# Altium schematic sheet LED PD AB WH 3000149 (4F00228L_7P00501A)_sch.SchDoc
size A3
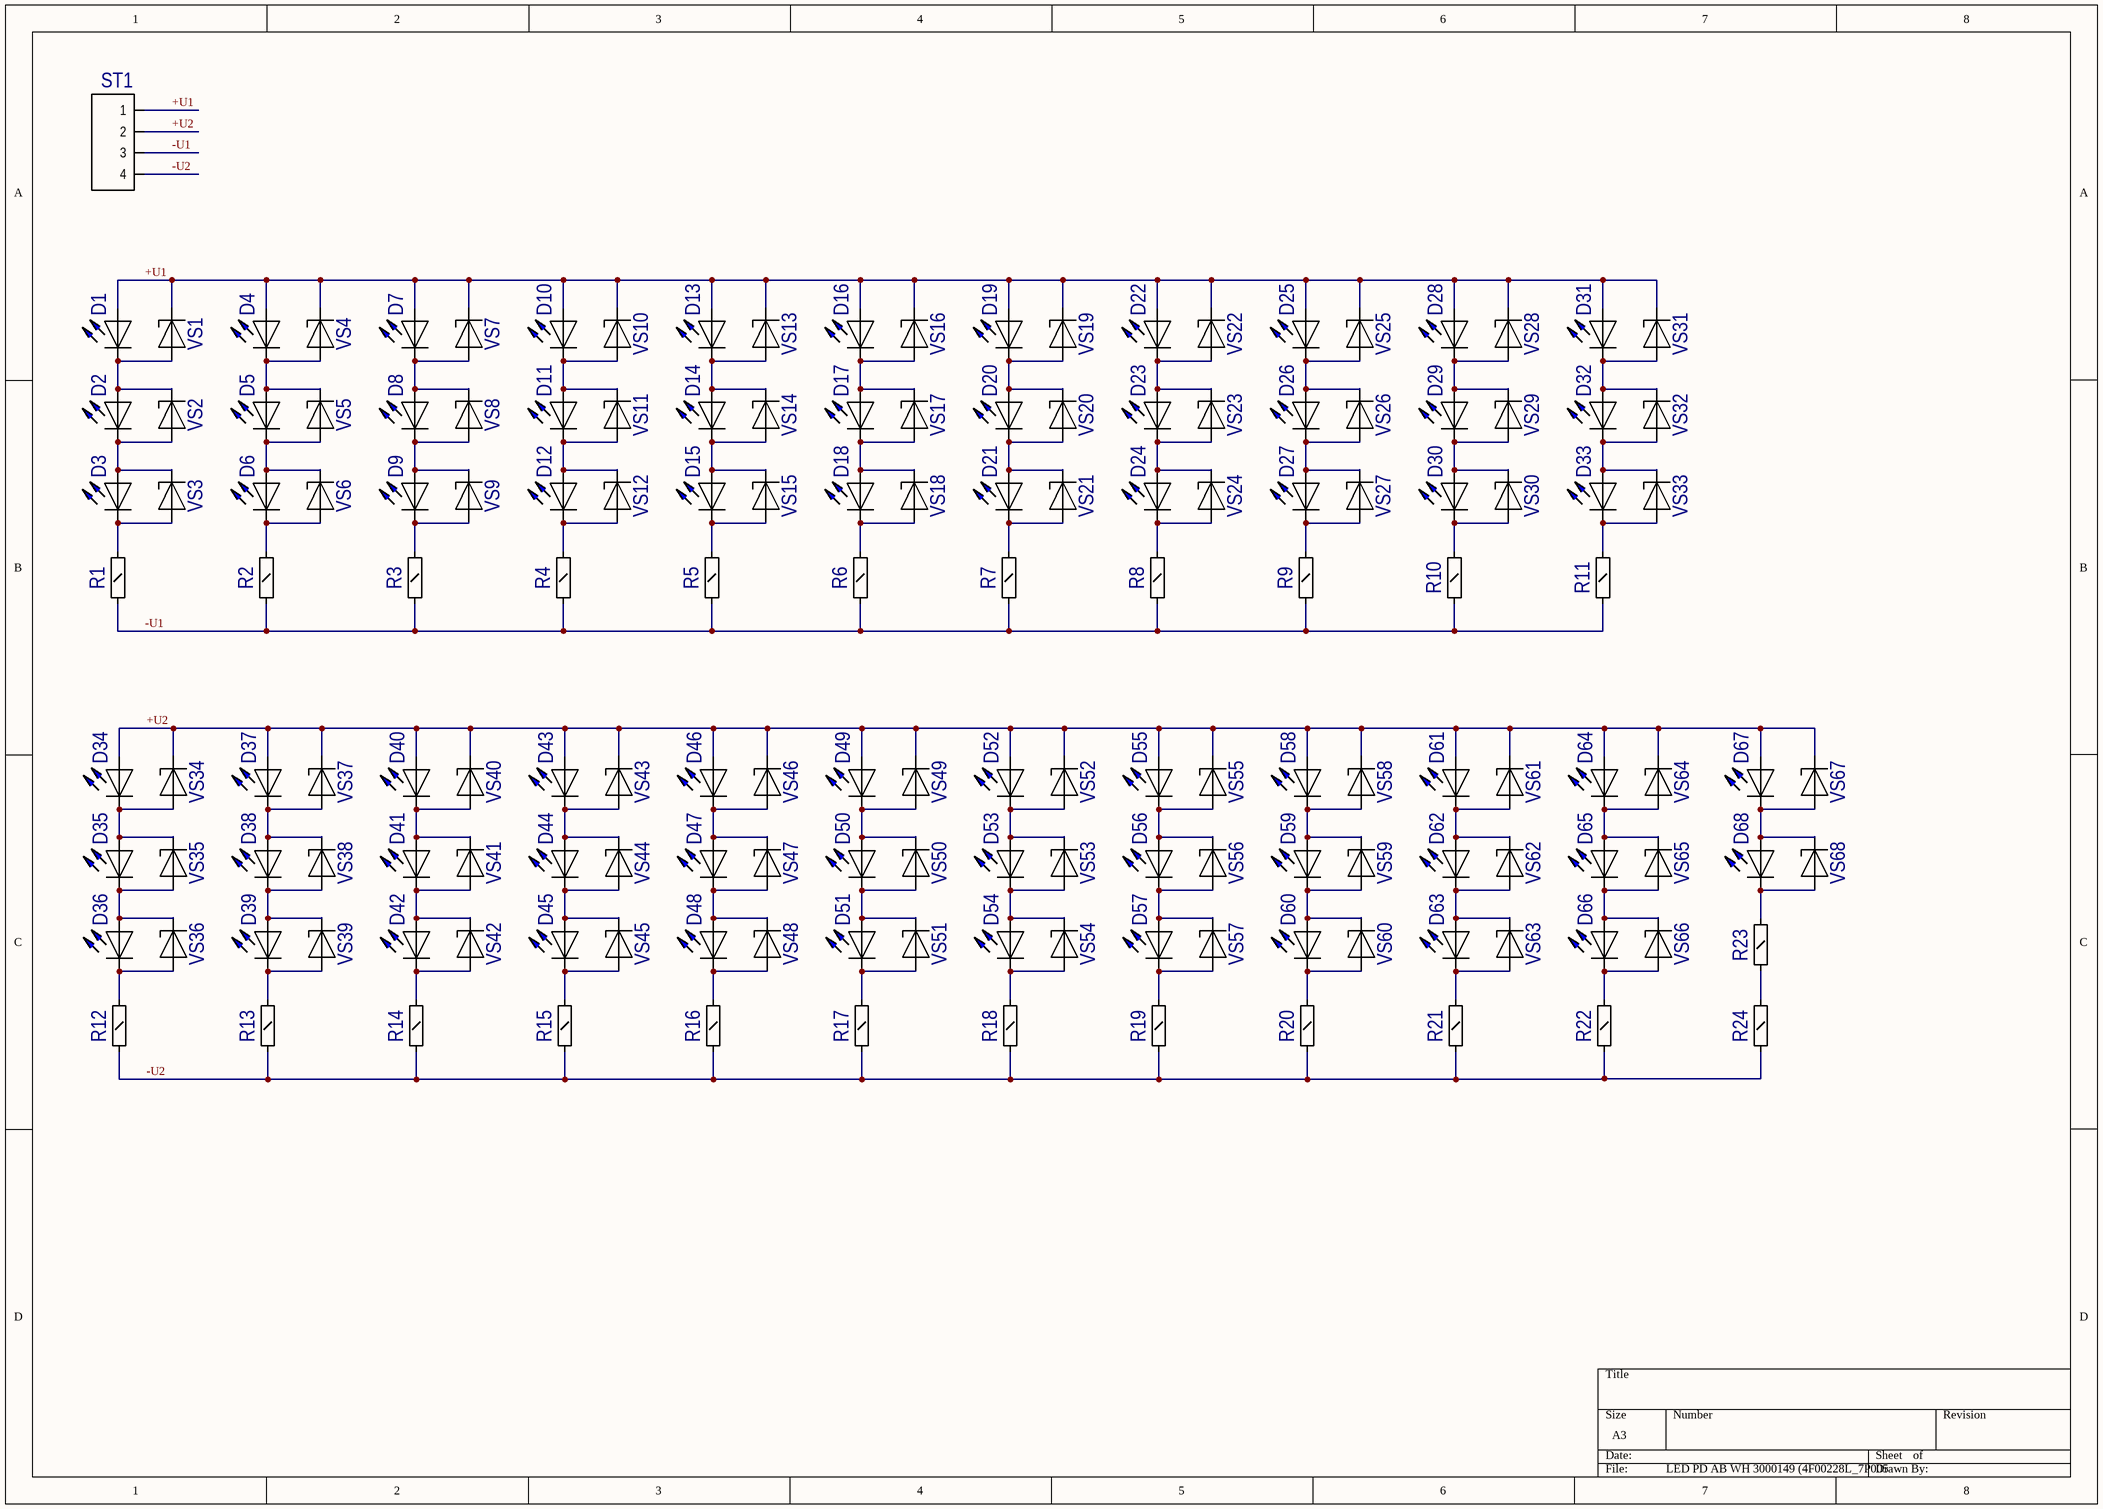
[diagram p0: LED PD AB WH 3000149 (4F00228L_7P00501A)_sch.SchDoc]

## Parts
D1  LT_T66G  [T66G]  (value not drawn)
D2  LT_T66G  [T66G]  (value not drawn)
D3  LT_T66G  [T66G]  (value not drawn)
D4  LT_T66G  [T66G]  (value not drawn)
D5  LT_T66G  [T66G]  (value not drawn)
D6  LT_T66G  [T66G]  (value not drawn)
D7  LT_T66G  [T66G]  (value not drawn)
D8  LT_T66G  [T66G]  (value not drawn)
D9  LT_T66G  [T66G]  (value not drawn)
D10  LT_T66G  [T66G]  (value not drawn)
D11  LT_T66G  [T66G]  (value not drawn)
D12  LT_T66G  [T66G]  (value not drawn)
D13  LT_T66G  [T66G]  (value not drawn)
D14  LT_T66G  [T66G]  (value not drawn)
D15  LT_T66G  [T66G]  (value not drawn)
D16  LT_T66G  [T66G]  (value not drawn)
D17  LT_T66G  [T66G]  (value not drawn)
D18  LT_T66G  [T66G]  (value not drawn)
D19  LT_T66G  [T66G]  (value not drawn)
D20  LT_T66G  [T66G]  (value not drawn)
D21  LT_T66G  [T66G]  (value not drawn)
D22  LT_T66G  [T66G]  (value not drawn)
D23  LT_T66G  [T66G]  (value not drawn)
D24  LT_T66G  [T66G]  (value not drawn)
D25  LT_T66G  [T66G]  (value not drawn)
D26  LT_T66G  [T66G]  (value not drawn)
D27  LT_T66G  [T66G]  (value not drawn)
D28  LT_T66G  [T66G]  (value not drawn)
D29  LT_T66G  [T66G]  (value not drawn)
D30  LT_T66G  [T66G]  (value not drawn)
D31  LT_T66G  [T66G]  (value not drawn)
D32  LT_T66G  [T66G]  (value not drawn)
D33  LT_T66G  [T66G]  (value not drawn)
D34  LT_T66G  [T66G]  (value not drawn)
D35  LT_T66G  [T66G]  (value not drawn)
D36  LT_T66G  [T66G]  (value not drawn)
D37  LT_T66G  [T66G]  (value not drawn)
D38  LT_T66G  [T66G]  (value not drawn)
D39  LT_T66G  [T66G]  (value not drawn)
D40  LT_T66G  [T66G]  (value not drawn)
D41  LT_T66G  [T66G]  (value not drawn)
D42  LT_T66G  [T66G]  (value not drawn)
D43  LT_T66G  [T66G]  (value not drawn)
D44  LT_T66G  [T66G]  (value not drawn)
D45  LT_T66G  [T66G]  (value not drawn)
D46  LT_T66G  [T66G]  (value not drawn)
D47  LT_T66G  [T66G]  (value not drawn)
D48  LT_T66G  [T66G]  (value not drawn)
D49  LT_T66G  [T66G]  (value not drawn)
D50  LT_T66G  [T66G]  (value not drawn)
D51  LT_T66G  [T66G]  (value not drawn)
D52  LT_T66G  [T66G]  (value not drawn)
D53  LT_T66G  [T66G]  (value not drawn)
D54  LT_T66G  [T66G]  (value not drawn)
D55  LT_T66G  [T66G]  (value not drawn)
D56  LT_T66G  [T66G]  (value not drawn)
D57  LT_T66G  [T66G]  (value not drawn)
D58  LT_T66G  [T66G]  (value not drawn)
D59  LT_T66G  [T66G]  (value not drawn)
D60  LT_T66G  [T66G]  (value not drawn)
D61  LT_T66G  [T66G]  (value not drawn)
D62  LT_T66G  [T66G]  (value not drawn)
D63  LT_T66G  [T66G]  (value not drawn)
D64  LT_T66G  [T66G]  (value not drawn)
D65  LT_T66G  [T66G]  (value not drawn)
D66  LT_T66G  [T66G]  (value not drawn)
D67  LT_T66G  [T66G]  (value not drawn)
D68  LT_T66G  [T66G]  (value not drawn)
R1  R1206S  [RC1206S]  (value not drawn)
R2  R1206S  [RC1206S]  (value not drawn)
R3  R1206S  [RC1206S]  (value not drawn)
R4  R1206S  [RC1206S]  (value not drawn)
R5  R1206S  [RC1206S]  (value not drawn)
R6  R1206S  [RC1206S]  (value not drawn)
R7  R1206S  [RC1206S]  (value not drawn)
R8  R1206S  [RC1206S]  (value not drawn)
R9  R1206S  [RC1206S]  (value not drawn)
R10  R1206S  [RC1206S]  (value not drawn)
R11  R1206S  [RC1206S]  (value not drawn)
R12  R1206S  [RC1206S]  (value not drawn)
R13  R1206S  [RC1206S]  (value not drawn)
R14  R1206S  [RC1206S]  (value not drawn)
R15  R1206S  [RC1206S]  (value not drawn)
R16  R1206S  [RC1206S]  (value not drawn)
R17  R1206S  [RC1206S]  (value not drawn)
R18  R1206S  [RC1206S]  (value not drawn)
R19  R1206S  [RC1206S]  (value not drawn)
R20  R1206S  [RC1206S]  (value not drawn)
R21  R1206S  [RC1206S]  (value not drawn)
R22  R1206S  [RC1206S]  (value not drawn)
R23  R1206S  [RC1206S]  (value not drawn)
R24  R1206S  [RC1206S]  (value not drawn)
ST1  BAND4  [BAND4]  (value not drawn)
VS1  BZX84  [SOT23]  (value not drawn)
VS2  BZX84  [SOT23]  (value not drawn)
VS3  BZX84  [SOT23]  (value not drawn)
VS4  BZX84  [SOT23]  (value not drawn)
VS5  BZX84  [SOT23]  (value not drawn)
VS6  BZX84  [SOT23]  (value not drawn)
VS7  BZX84  [SOT23]  (value not drawn)
VS8  BZX84  [SOT23]  (value not drawn)
VS9  BZX84  [SOT23]  (value not drawn)
VS10  BZX84  [SOT23]  (value not drawn)
VS11  BZX84  [SOT23]  (value not drawn)
VS12  BZX84  [SOT23]  (value not drawn)
VS13  BZX84  [SOT23]  (value not drawn)
VS14  BZX84  [SOT23]  (value not drawn)
VS15  BZX84  [SOT23]  (value not drawn)
VS16  BZX84  [SOT23]  (value not drawn)
VS17  BZX84  [SOT23]  (value not drawn)
VS18  BZX84  [SOT23]  (value not drawn)
VS19  BZX84  [SOT23]  (value not drawn)
VS20  BZX84  [SOT23]  (value not drawn)
VS21  BZX84  [SOT23]  (value not drawn)
VS22  BZX84  [SOT23]  (value not drawn)
VS23  BZX84  [SOT23]  (value not drawn)
VS24  BZX84  [SOT23]  (value not drawn)
VS25  BZX84  [SOT23]  (value not drawn)
VS26  BZX84  [SOT23]  (value not drawn)
VS27  BZX84  [SOT23]  (value not drawn)
VS28  BZX84  [SOT23]  (value not drawn)
VS29  BZX84  [SOT23]  (value not drawn)
VS30  BZX84  [SOT23]  (value not drawn)
VS31  BZX84  [SOT23]  (value not drawn)
VS32  BZX84  [SOT23]  (value not drawn)
VS33  BZX84  [SOT23]  (value not drawn)
VS34  BZX84  [SOT23]  (value not drawn)
VS35  BZX84  [SOT23]  (value not drawn)
VS36  BZX84  [SOT23]  (value not drawn)
VS37  BZX84  [SOT23]  (value not drawn)
VS38  BZX84  [SOT23]  (value not drawn)
VS39  BZX84  [SOT23]  (value not drawn)
VS40  BZX84  [SOT23]  (value not drawn)
VS41  BZX84  [SOT23]  (value not drawn)
VS42  BZX84  [SOT23]  (value not drawn)
VS43  BZX84  [SOT23]  (value not drawn)
VS44  BZX84  [SOT23]  (value not drawn)
VS45  BZX84  [SOT23]  (value not drawn)
VS46  BZX84  [SOT23]  (value not drawn)
VS47  BZX84  [SOT23]  (value not drawn)
VS48  BZX84  [SOT23]  (value not drawn)
VS49  BZX84  [SOT23]  (value not drawn)
VS50  BZX84  [SOT23]  (value not drawn)
VS51  BZX84  [SOT23]  (value not drawn)
VS52  BZX84  [SOT23]  (value not drawn)
VS53  BZX84  [SOT23]  (value not drawn)
VS54  BZX84  [SOT23]  (value not drawn)
VS55  BZX84  [SOT23]  (value not drawn)
VS56  BZX84  [SOT23]  (value not drawn)
VS57  BZX84  [SOT23]  (value not drawn)
VS58  BZX84  [SOT23]  (value not drawn)
VS59  BZX84  [SOT23]  (value not drawn)
VS60  BZX84  [SOT23]  (value not drawn)
VS61  BZX84  [SOT23]  (value not drawn)
VS62  BZX84  [SOT23]  (value not drawn)
VS63  BZX84  [SOT23]  (value not drawn)
VS64  BZX84  [SOT23]  (value not drawn)
VS65  BZX84  [SOT23]  (value not drawn)
VS66  BZX84  [SOT23]  (value not drawn)
VS67  BZX84  [SOT23]  (value not drawn)
VS68  BZX84  [SOT23]  (value not drawn)

## Nets
+U1: D1.2 D4.2 D7.2 D10.2 D13.2 D16.2 D19.2 D22.2 D25.2 D28.2 D31.2 ST1.1 VS1.3 VS4.3 VS7.3 VS10.3 VS13.3 VS16.3 VS19.3 VS22.3 VS25.3 VS28.3 VS31.3
+U2: D34.2 D37.2 D40.2 D43.2 D46.2 D49.2 D52.2 D55.2 D58.2 D61.2 D64.2 D67.2 ST1.2 VS34.3 VS37.3 VS40.3 VS43.3 VS46.3 VS49.3 VS52.3 VS55.3 VS58.3 VS61.3 VS64.3 VS67.3
-U1: R1.1 R2.1 R3.1 R4.1 R5.1 R6.1 R7.1 R8.1 R9.1 R10.1 R11.1 ST1.3
-U2: R12.1 R13.1 R14.1 R15.1 R16.1 R17.1 R18.1 R19.1 R20.1 R21.1 R22.1 R24.1 ST1.4
NetD1_1: D1.1 D2.2 VS1.1 VS2.3
NetD2_1: D2.1 D3.2 VS2.1 VS3.3
NetD3_1: D3.1 R1.2 VS3.1
NetD4_1: D4.1 D5.2 VS4.1 VS5.3
NetD5_1: D5.1 D6.2 VS5.1 VS6.3
NetD6_1: D6.1 R2.2 VS6.1
NetD7_1: D7.1 D8.2 VS7.1 VS8.3
NetD8_1: D8.1 D9.2 VS8.1 VS9.3
NetD9_1: D9.1 R3.2 VS9.1
NetD10_1: D10.1 D11.2 VS10.1 VS11.3
NetD11_1: D11.1 D12.2 VS11.1 VS12.3
NetD12_1: D12.1 R4.2 VS12.1
NetD13_1: D13.1 D14.2 VS13.1 VS14.3
NetD14_1: D14.1 D15.2 VS14.1 VS15.3
NetD15_1: D15.1 R5.2 VS15.1
NetD16_1: D16.1 D17.2 VS16.1 VS17.3
NetD17_1: D17.1 D18.2 VS17.1 VS18.3
NetD18_1: D18.1 R6.2 VS18.1
NetD19_1: D19.1 D20.2 VS19.1 VS20.3
NetD20_1: D20.1 D21.2 VS20.1 VS21.3
NetD21_1: D21.1 R7.2 VS21.1
NetD22_1: D22.1 D23.2 VS22.1 VS23.3
NetD23_1: D23.1 D24.2 VS23.1 VS24.3
NetD24_1: D24.1 R8.2 VS24.1
NetD25_1: D25.1 D26.2 VS25.1 VS26.3
NetD26_1: D26.1 D27.2 VS26.1 VS27.3
NetD27_1: D27.1 R9.2 VS27.1
NetD28_1: D28.1 D29.2 VS28.1 VS29.3
NetD29_1: D29.1 D30.2 VS29.1 VS30.3
NetD30_1: D30.1 R10.2 VS30.1
NetD31_1: D31.1 D32.2 VS31.1 VS32.3
NetD32_1: D32.1 D33.2 VS32.1 VS33.3
NetD33_1: D33.1 R11.2 VS33.1
NetD34_1: D34.1 D35.2 VS34.1 VS35.3
NetD35_1: D35.1 D36.2 VS35.1 VS36.3
NetD36_1: D36.1 R12.2 VS36.1
NetD37_1: D37.1 D38.2 VS37.1 VS38.3
NetD38_1: D38.1 D39.2 VS38.1 VS39.3
NetD39_1: D39.1 R13.2 VS39.1
NetD40_1: D40.1 D41.2 VS40.1 VS41.3
NetD41_1: D41.1 D42.2 VS41.1 VS42.3
NetD42_1: D42.1 R14.2 VS42.1
NetD43_1: D43.1 D44.2 VS43.1 VS44.3
NetD44_1: D44.1 D45.2 VS44.1 VS45.3
NetD45_1: D45.1 R15.2 VS45.1
NetD46_1: D46.1 D47.2 VS46.1 VS47.3
NetD47_1: D47.1 D48.2 VS47.1 VS48.3
NetD48_1: D48.1 R16.2 VS48.1
NetD49_1: D49.1 D50.2 VS49.1 VS50.3
NetD50_1: D50.1 D51.2 VS50.1 VS51.3
NetD51_1: D51.1 R17.2 VS51.1
NetD52_1: D52.1 D53.2 VS52.1 VS53.3
NetD53_1: D53.1 D54.2 VS53.1 VS54.3
NetD54_1: D54.1 R18.2 VS54.1
NetD55_1: D55.1 D56.2 VS55.1 VS56.3
NetD56_1: D56.1 D57.2 VS56.1 VS57.3
NetD57_1: D57.1 R19.2 VS57.1
NetD58_1: D58.1 D59.2 VS58.1 VS59.3
NetD59_1: D59.1 D60.2 VS59.1 VS60.3
NetD60_1: D60.1 R20.2 VS60.1
NetD61_1: D61.1 D62.2 VS61.1 VS62.3
NetD62_1: D62.1 D63.2 VS62.1 VS63.3
NetD63_1: D63.1 R21.2 VS63.1
NetD64_1: D64.1 D65.2 VS64.1 VS65.3
NetD65_1: D65.1 D66.2 VS65.1 VS66.3
NetD66_1: D66.1 R22.2 VS66.1
NetD67_1: D67.1 D68.2 VS67.1 VS68.3
NetD68_1: D68.1 R23.2 VS68.1
NetR23_1: R23.1 R24.2

Not connected (* = marked no-connect by the designer): ST1 5 6 7 8; VS1 2; VS2 2; VS3 2; VS4 2; VS5 2; VS6 2; VS7 2; VS8 2; VS9 2; VS10 2; VS11 2; VS12 2; VS13 2; VS14 2; VS15 2; VS16 2; VS17 2; VS18 2; VS19 2; VS20 2; VS21 2; VS22 2; VS23 2; VS24 2; VS25 2; VS26 2; VS27 2; VS28 2; VS29 2; VS30 2; VS31 2; VS32 2; VS33 2; VS34 2; VS35 2; VS36 2; VS37 2; VS38 2; VS39 2; VS40 2; VS41 2; VS42 2; VS43 2; VS44 2; VS45 2; VS46 2; VS47 2; VS48 2; VS49 2; VS50 2; VS51 2; VS52 2; VS53 2; VS54 2; VS55 2; VS56 2; VS57 2; VS58 2; VS59 2; VS60 2; VS61 2; VS62 2; VS63 2; VS64 2; VS65 2; VS66 2; VS67 2; VS68 2

## Library data of the parts
D1-D68 = LT_T66G: {Description}
R1-R22 R24 = R1206S: Value: Pos.20
R23 = R1206S: Value: Pos.22
VS1-VS68 = BZX84: OriginalName: DIODE; Value: *
ST1 = BAND4: Value: *